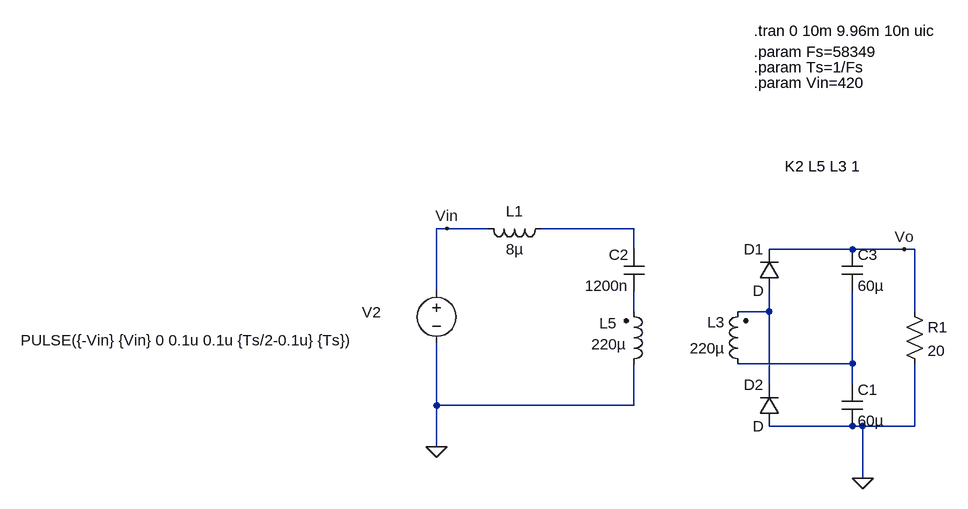
[diagram p0: schematic LLC 1-phase.asc]
LLC 1-phase.asc, the LTspice schematic file:
Version 4
SHEET 1 880 1140
WIRE -528 -96 -544 -96
WIRE -464 -96 -528 -96
WIRE -240 -96 -384 -96
WIRE -240 -64 -240 -96
WIRE 96 -64 -32 -64
WIRE 176 -64 96 -64
WIRE 192 -64 176 -64
WIRE -544 0 -544 -96
WIRE -240 32 -240 0
WIRE -32 32 -32 0
WIRE -32 32 -80 32
WIRE 192 32 192 -64
WIRE 96 112 96 0
WIRE 96 112 -80 112
WIRE -32 144 -32 32
WIRE 96 144 96 112
WIRE -544 176 -544 80
WIRE -240 176 -240 112
WIRE -240 176 -544 176
WIRE 96 208 -32 208
WIRE 112 208 96 208
WIRE 192 208 192 112
WIRE 192 208 112 208
WIRE -544 240 -544 176
WIRE 112 288 112 208
FLAG 112 288 0
FLAG 176 -64 Vo
FLAG -544 240 0
FLAG -528 -96 Vin
SYMBOL ind -480 -112 M90
WINDOW 0 5 56 VBottom 2
WINDOW 3 32 56 VTop 2
SYMATTR InstName L1
SYMATTR Value 8µ
SYMBOL ind2 -64 128 R180
WINDOW 0 36 80 Left 2
WINDOW 3 36 40 Left 2
SYMATTR InstName L3
SYMATTR Value 220µ
SYMATTR Type ind
SYMBOL diode -16 0 R180
WINDOW 0 24 64 Left 2
WINDOW 3 24 0 Left 2
SYMATTR InstName D1
SYMBOL cap 80 144 R0
SYMATTR InstName C1
SYMATTR Value 60µ
SYMBOL res 176 16 R0
SYMATTR InstName R1
SYMATTR Value 20
SYMBOL diode -16 208 R180
WINDOW 0 24 64 Left 2
WINDOW 3 24 0 Left 2
SYMATTR InstName D2
SYMBOL cap -224 0 R180
WINDOW 0 24 56 Left 2
WINDOW 3 24 8 Left 2
SYMATTR InstName C2
SYMATTR Value 1200n
SYMBOL cap 80 -64 R0
SYMATTR InstName C3
SYMATTR Value 60µ
SYMBOL ind2 -256 128 M180
WINDOW 0 -37 78 Left 2
WINDOW 3 -50 46 Left 2
SYMATTR InstName L5
SYMATTR Value 220µ
SYMATTR Type ind
SYMBOL voltage -544 -16 R0
WINDOW 123 0 0 Left 0
WINDOW 39 0 0 Left 0
WINDOW 3 -640 92 Left 2
WINDOW 0 -115 49 Left 2
SYMATTR Value PULSE({-Vin} {Vin} 0 0.1u 0.1u {Ts/2-0.1u} {Ts})
SYMATTR InstName V2
TEXT -8 -192 Left 2 !K2 L5 L3 1
TEXT -56 -400 Left 2 !.tran 0 10m 9.96m 10n uic
TEXT -56 -368 Left 2 !.param Fs=58349
TEXT -56 -344 Left 2 !.param Ts=1/Fs
TEXT -56 -320 Left 2 !.param Vin=420

The netlist it stands for:
* LLC 1-phase.asc
L1 Vin N001 8µ
L3 N004 N003 220µ
D1 N003 Vo D
C1 N004 0 60µ
R1 Vo 0 20
D2 0 N003 D
C2 N002 N001 1200n
C3 Vo N004 60µ
L5 0 N002 220µ
V2 Vin 0 PULSE({-Vin} {Vin} 0 0.1u 0.1u {Ts/2-0.1u} {Ts})
.model D D
.lib standard.dio
K2 L5 L3 1
.tran 0 10m 9.96m 10n uic
.param Fs=58349
.param Ts=1/Fs
.param Vin=420
.backanno
.end